# Altium schematic sheet Power.SchDoc
size B; Organization: ORGANIZATION; Address1: ADDRESS 1; Address2: ADDRESS 2; Address3: ADDRESS 3; Address4: ADDRESS 4; Revision: -; SheetNumber: 3; SheetTotal: 7; ENG_APP_DATE: --/--/--; DSN_APP_DATE: --/--/--; CHK_APP_DATE: --/--/--
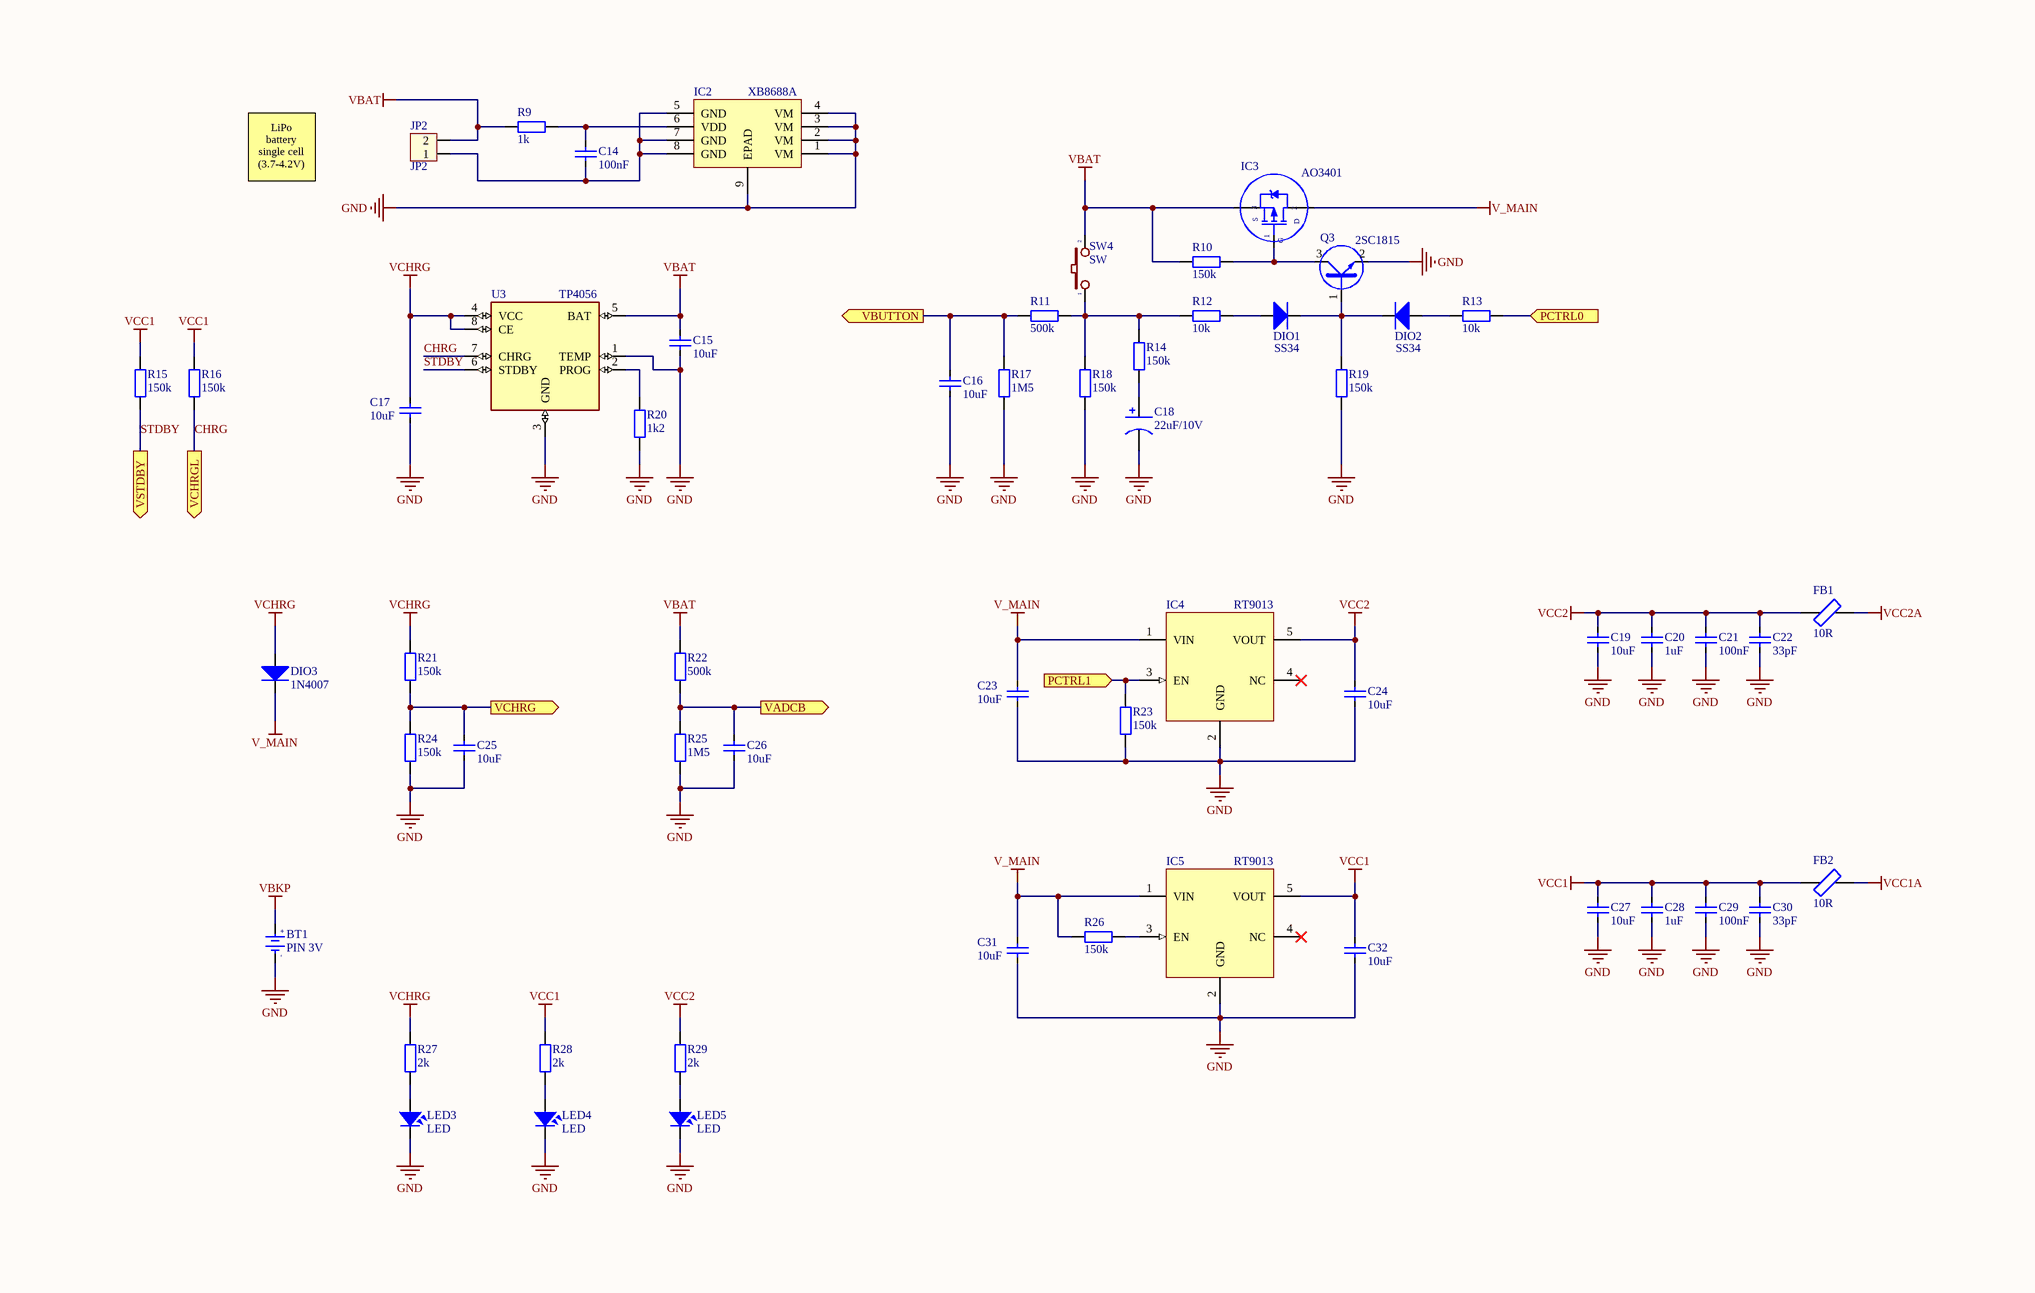
[diagram p0: Power.SchDoc]

## Parts
BT1  PIN 3V  [CR1220 SMD]
C14  100nF  [CAP_0603]
C15  10uF  [CAP_0603]
C16  10uF  [CAP_0603]
C17  10uF  [CAP_0603]
C18  22uF/10V  [C3MM]
C19  10uF  [CAP_0603]
C20  1uF  [CAP_0603]
C21  100nF  [CAP_0603]
C22  33pF  [CAP_0603]
C23  10uF  [CAP_0603]
C24  10uF  [CAP_0603]
C25  10uF  [CAP_0603]
C26  10uF  [CAP_0603]
C27  10uF  [CAP_0603]
C28  1uF  [CAP_0603]
C29  100nF  [CAP_0603]
C30  33pF  [CAP_0603]
C31  10uF  [CAP_0603]
C32  10uF  [CAP_0603]
DIO1  SS34  [DIO-214AC(SMA)]
DIO2  SS34  [DIO-214AC(SMA)]
DIO3  1N4007  [DIO-214AC(SMA)]
FB1  10R  [RES-SMD-0805]
FB2  10R  [RES-SMD-0805]
IC2  XB8688A  [SOP8-PP]
IC3  AO3401  [SOT23A]
IC4  RT9013  [SOT23-5]
IC5  RT9013  [SOT23-5]
JP2  JP2  [CON2]
LED3  LED  [LED-0805-Red]
LED4  LED  [LED-0805-Red]
LED5  LED  [LED-0805-Red]
Q3  2SC1815  [SOT23D]
R9  1k  [RES-SMD-0603]
R10  150k  [RES-SMD-0603]
R11  500k  [RES-SMD-0603]
R12  10k  [RES-SMD-0603]
R13  10k  [RES-SMD-0603]
R14  150k  [RES-SMD-0603]
R15  150k  [RES-SMD-0603]
R16  150k  [RES-SMD-0603]
R17  1M5  [RES-SMD-0603]
R18  150k  [RES-SMD-0603]
R19  150k  [RES-SMD-0603]
R20  1k2  [RES-SMD-0603]
R21  150k  [RES-SMD-0603]
R22  500k  [RES-SMD-0603]
R23  150k  [RES-SMD-0603]
R24  150k  [RES-SMD-0603]
R25  1M5  [RES-SMD-0603]
R26  150k  [RES-SMD-0603]
R27  2k  [RES-SMD-0603]
R28  2k  [RES-SMD-0603]
R29  2k  [RES-SMD-0603]
SW4  SW  [SW2-D2]
U3  TP4056  [TP4056]

## Ports
PCTRL0 (in), PCTRL1 (in), VADCB (out), VBUTTON (out), VCHRG (out), VCHRGL (out), VSTDBY (out)

## Nets
GND: BT1.2(GND) C15.1 C16.1 C17.1 C18.2 C19.1 C20.1 C21.1 C22.1 C23.1 C24.1 C25.1 C26.1 C27.1 C28.1 C29.1 C30.1 C31.1 C32.1 IC2.1(VM) IC2.2(VM) IC2.3(VM) IC2.4(VM) IC2.9(EPAD) IC4.2(GND) IC5.2(GND) LED3.2 LED4.2 LED5.2 Q3.2(E) R17.1 R18.2 R19.2 R20.1 R23.1 R24.2 R25.1 U3.1(TEMP) U3.3(GND)
V_MAIN: C23.2 C31.2 DIO3.2(K) IC3.2(D) IC4.1(VIN) IC5.1(VIN) R26.1
VBAT: C15.2 IC3.3(S) JP2.2 R9.1 R10.1 R22.2 SW4.2 U3.5(BAT)
VBKP: BT1.1(+3V)
VCC1: C27.2 C28.2 C29.2 C30.2 C32.2 FB2.1 IC5.5(VOUT) R15.1 R16.1 R28.2
VCC1A: FB2.2
VCC2: C19.2 C20.2 C21.2 C22.2 C24.2 FB1.1 IC4.5(VOUT) R29.2
VCC2A: FB1.2
VCHRG: C17.2 DIO3.1(A) R21.1 R27.2 U3.4(VCC) U3.8(CE)
CHRG: R16.2 U3.7(CHRG) ; port VCHRGL
PCTRL0: R13.2 ; port PCTRL0
PCTRL1: IC4.3(EN) R23.2 ; port PCTRL1
STDBY: R15.2 U3.6(STDBY) ; port VSTDBY
VADCB: C26.2 R22.1 R25.2 ; port VADCB
VBUTTON: C16.2 R11.2 R17.2 ; port VBUTTON
VCHRG: C25.2 R21.2 R24.1 ; port VCHRG  [a separate net that carries the same name]
NetC14_1: C14.1 IC2.5(GND) IC2.7(GND) IC2.8(GND) JP2.1
NetC14_2: C14.2 IC2.6(VDD) R9.2
NetC18_1: C18.1 R14.2
NetDIO1_1: DIO1.1(A) R12.2
NetDIO1_2: DIO1.2(K) DIO2.2(K) Q3.1(B) R19.1
NetDIO2_1: DIO2.1(A) R13.1
NetIC3_1: IC3.1(G) Q3.3(C) R10.2
NetIC5_3: IC5.3(EN) R26.2
NetLED3_1: LED3.1 R27.1
NetLED4_1: LED4.1 R28.1
NetLED5_1: LED5.1 R29.1
NetR11_1: R11.1 R12.1 R14.1 R18.1 SW4.1
NetR20_2: R20.2 U3.2(PROG)

Not connected (* = marked no-connect by the designer): IC4 4(NC)*; IC5 4(NC)*

## Notes on the sheet
- LiPo battery single cell (3.7-4.2V)
- DWG. NO.
- REV.
- SHT.
- THIS DOCUMENT AND THE DATA DISCLOSED HEREIN OR HEREWITH IS THE PROPERTY OF ALTIUM LIMITED AND MAY BE FREELY DISTRIBUTED IN WHOLE. NO RIGHTS ARE RESERVED OR EXPRESS OR IMPLIED WARANTEE GIVEN.
- REVISION
- DESCRIPTION
- DATE
- APPROVED
- ENG:
- APPROVALS
- PROJECT
- DSN:
- CHK:
- REFERENCE DOCUMENTS
- PROJECT REVISION:
- TITLE
- DOCUMENT REVISION:
- DESIGN ITEM:
- BOM:
- FAB DWG:
- PCB DWG:
- ASSY DWG:
- SCALE:
- SIZE
- B
- CAGE CODE
- FILE NAME
- DWG NO.
- SHEET
- OF
- REV
- (in symbol PIN 3V) +; -

## Library data of the parts
BT1 = PIN 3V: Battery 3VDC; Value: PIN 3V
C14-C17 C19-C32 = CapSMD: Capacitor; Value: 33p; Published: 8-Jun-2000; LatestRevisionDate: 17-Jul-2002; LatestRevisionNote: Re-released for DXP Platform.; PackageReference: RAD-0.3; Publisher: Altium Limited
C18 = Cap Pol: Polarized Capacitor (Axial); Published: 8-Jun-2000; LatestRevisionDate: 17-Jul-2002; LatestRevisionNote: Re-released for DXP Platform.; PackageReference: POLAR0.8; Publisher: Altium Limited
DIO1-DIO3 = Diode SMD: Default Diode; Code - JEDEC: DO-214-AB; Value: 1N5007; Published: 8-Jun-2000; Revision: July-2002: Re-released for DXP Platform.; Publisher: Altium Limited
FB1 FB2 = Ferrit Bead: Generic Ferrit Bead
IC2 = XB8688: One Cell Lithium-ion/Polymer Battery Protection IC
IC3 = MOSFET_P: Generic P Channel MOSFET
IC4 IC5 = RT9013: RT9013-33GB IC REG LINEAR 3.3V 500mA SOT23-5
JP2 = Con2: Connector 2; Value: Connector 2
LED3-LED5 = LED: LED Single colour Green and Red; Value: LED 3 ly Single Colour
Q3 = C1815: NPN 600mW, ECB; Value: C1815
R9-R29 = Resistor - SMD: Resistor SMD; Manufacturer: Generic Components; Class: Passive; Published: 08/06/2000; Publisher: Altium Hobart Technology Centre
SW4 = SW2: Switch button 2 pin; Value: SW chip 2 pin
U3 = TP4056: Complete single cell Li-Ion battery with a constant current / constant voltage linear charger